# Altium project Timer_Clock.PrjPcb
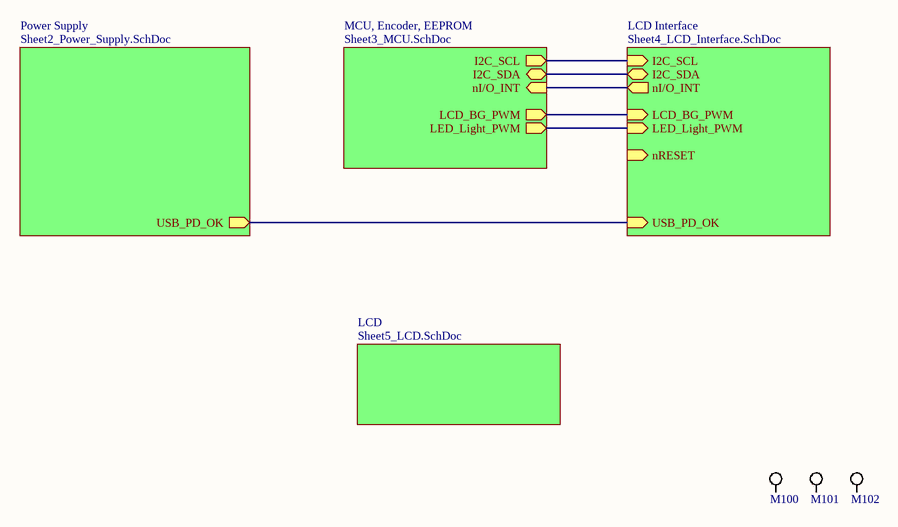
[diagram p0: Sheet1_Overview.SchDoc]
5 sheets, 173 parts. Net scope: hierarchical (ports join the sheet entries above them; power ports are global).
Sheets:
  Sheet1_Overview.SchDoc
    Power Supply = Sheet2_Power_Supply.SchDoc
    MCU, Encoder, EEPROM = Sheet3_MCU.SchDoc
    LCD = Sheet5_LCD.SchDoc
    LCD Interface = Sheet4_LCD_Interface.SchDoc

## Sheet Sheet1_Overview.SchDoc: =ProjectName
size A4; DocumentNumber: 1; SheetNumber: 1; SheetTotal: 5

### Parts
M100  M3x8  [SCREW_M3x8_nP_FH]  (value not drawn)  (net tie, no BOM)
M101  M3x8  [SCREW_M3x8_nP_FH]  (value not drawn)  (net tie, no BOM)
M102  M3x8  [SCREW_M3x8_nP_FH]  (value not drawn)  (net tie, no BOM)

### Sub-sheets
LCD = Sheet5_LCD.SchDoc: no entries
LCD Interface = Sheet4_LCD_Interface.SchDoc: nI/O_INT (out), I2C_SCL (in), LCD_BG_PWM (in), nRESET (in), LED_Light_PWM (in), I2C_SDA (bidir), USB_PD_OK (in)
MCU, Encoder, EEPROM = Sheet3_MCU.SchDoc: nI/O_INT (in), I2C_SCL (out), LCD_BG_PWM (out), LED_Light_PWM (out), I2C_SDA (bidir)
Power Supply = Sheet2_Power_Supply.SchDoc: USB_PD_OK (out)

### Nets
I2C_SCL: sheet MCU, Encoder, EEPROM/I2C_SCL, sheet LCD Interface/I2C_SCL
I2C_SDA: sheet MCU, Encoder, EEPROM/I2C_SDA, sheet LCD Interface/I2C_SDA
LCD_BG_PWM: sheet MCU, Encoder, EEPROM/LCD_BG_PWM, sheet LCD Interface/LCD_BG_PWM
LED_Light_PWM: sheet MCU, Encoder, EEPROM/LED_Light_PWM, sheet LCD Interface/LED_Light_PWM
nI/O_INT: sheet MCU, Encoder, EEPROM/nI/O_INT, sheet LCD Interface/nI/O_INT
NetP201_3: sheet Power Supply/USB_PD_OK, sheet LCD Interface/USB_PD_OK

### Notes on the sheet
- Title
- Size:
- Date:
- A4
- Number:
- Time:
- Revision:
- Sheet
- of
- File:

### Library data of the parts
M100-M102 = SCREW_M3x8_nP_FH: Skrew M3x8 Not Plated Flathat

## Sheet Sheet2_Power_Supply.SchDoc: =ProjectName
size A4; DocumentNumber: 2; SheetNumber: 2; SheetTotal: 5
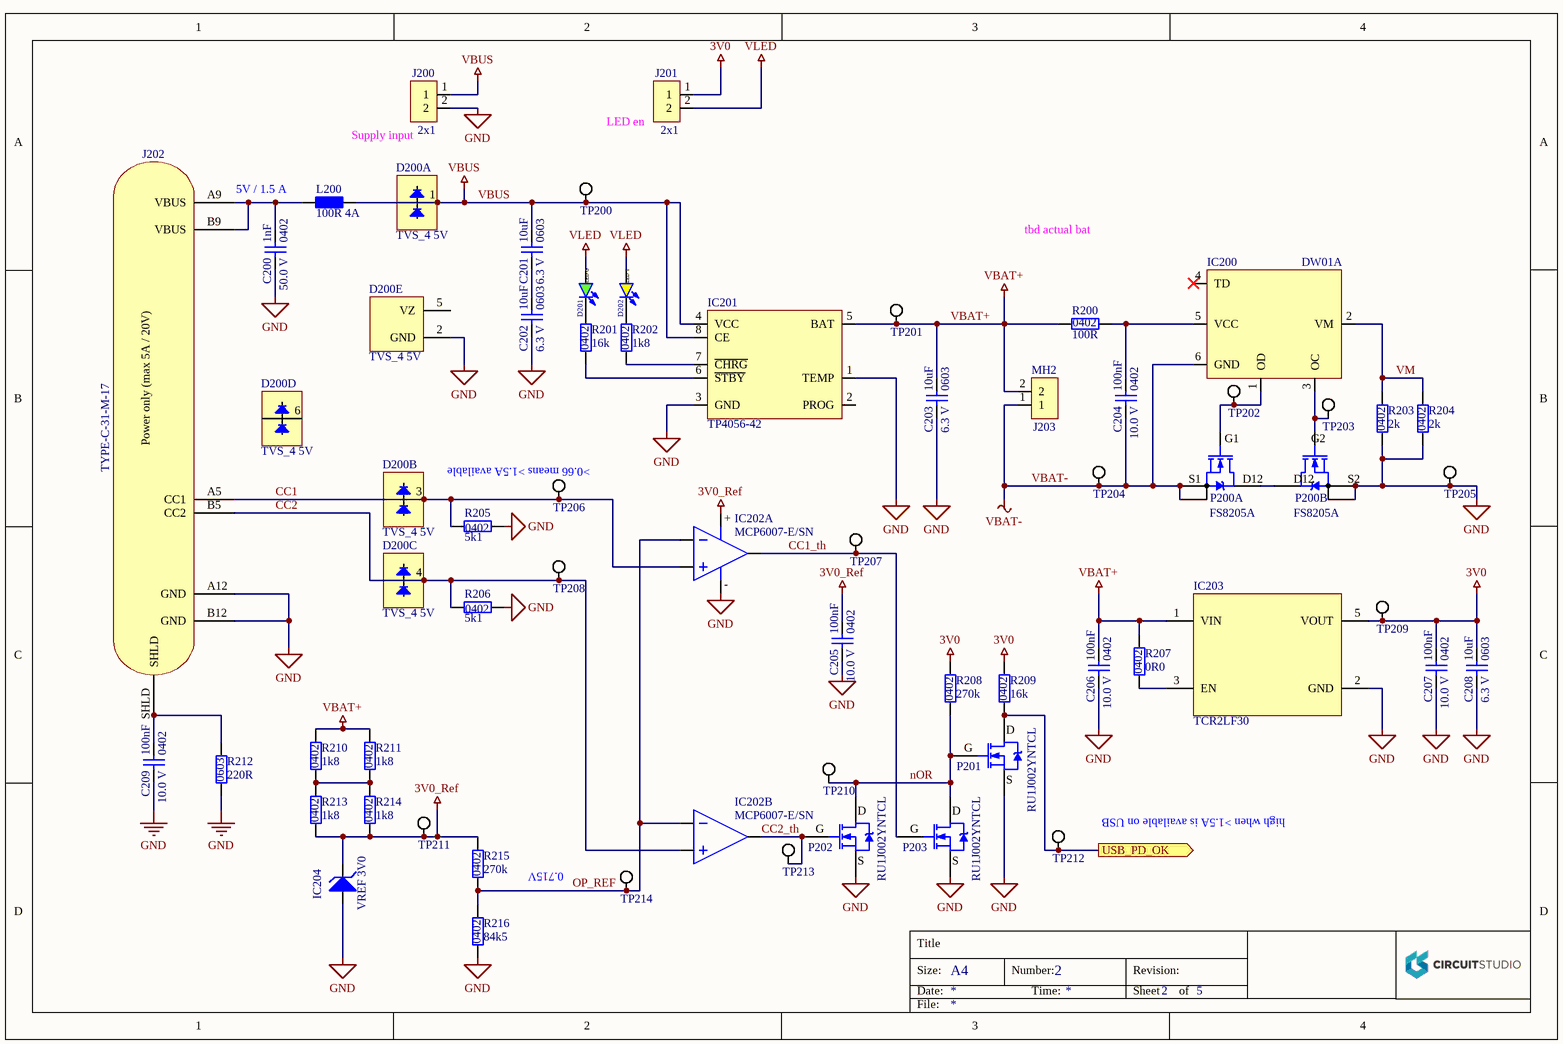
[diagram p1: Sheet2_Power_Supply.SchDoc]

### Parts
C200  Capacitance: 1nF  Footprint: 0402  Voltage: 50.0 V  [C_0402]  (hidden comment: C 1nF 0402 50V)
C201  Capacitance: 10uF  Footprint: 0603  Voltage: 6.3 V  [C_0603]  (hidden comment: C 10uF 0603 6.3V)
C202  Capacitance: 10uF  Footprint: 0603  Voltage: 6.3 V  [C_0603]  (hidden comment: C 10uF 0603 6.3V)
C203  Capacitance: 10uF  Footprint: 0603  Voltage: 6.3 V  [C_0603]  (hidden comment: C 10uF 0603 6.3V)
C204  Capacitance: 100nF  Footprint: 0402  Voltage: 10.0 V  [C_0402]  (hidden comment: C 100nF 0402 10V)
C205  Capacitance: 100nF  Footprint: 0402  Voltage: 10.0 V  [C_0402]  (hidden comment: C 100nF 0402 10V)
C206  Capacitance: 100nF  Footprint: 0402  Voltage: 10.0 V  [C_0402]  (hidden comment: C 100nF 0402 10V)
C207  Capacitance: 100nF  Footprint: 0402  Voltage: 10.0 V  [C_0402]  (hidden comment: C 100nF 0402 10V)
C208  Capacitance: 10uF  Footprint: 0603  Voltage: 6.3 V  [C_0603]  (hidden comment: C 10uF 0603 6.3V)
C209  Capacitance: 100nF  Footprint: 0402  Voltage: 10.0 V  [C_0402]  (hidden comment: C 100nF 0402 10V)
D200  TVS_4 5V  [SOT-23-6]  (parts A,B,C,D,E of 5)
D201  LED G  [LED_0603]
D202  LED Y  [LED_0603]
IC200  DW01A  [SOT-23-6]
IC201  TP4056-42  [SOIC-8-EP]
IC202  MCP6007-E/SN  [SOIC-8]  (parts A,B of 2)
IC203  TCR2LF30  [SOT-23-5]
IC204  VREF 3V0  [SOT-23-3]
J200  2x1  [PH_1x2]
J201  2x1  [PH_1x2]
J202  TYPE-C-31-M-17  [Con_TYPE-C-31-M-17]
J203  MH2  [J_S2B-PH-K-S]
L200  Inductance: 100R 4A  [L_1206]  (hidden comment: L Ferrite 100R 4A)
P200  Manufacturer Part Number: FS8205A  [TSSOP-8_4.4mm]  (hidden comment: P2 NMOS 20V 6A)  (parts A,B of 2)
P201  Manufacturer Part Number: RU1J002YNTCL  [UMT3F]  (hidden comment: P_NCH_50V_150mW)
P202  Manufacturer Part Number: RU1J002YNTCL  [UMT3F]  (hidden comment: P_NCH_50V_150mW)
P203  Manufacturer Part Number: RU1J002YNTCL  [UMT3F]  (hidden comment: P_NCH_50V_150mW)
R200  Resistance: 100R  Footprint: 0402  [R_0402]  (hidden comment: R 100R 0402)
R201  Resistance: 16k  Footprint: 0402  [R_0402]  (hidden comment: R 16k 0402)
R202  Resistance: 1k8  Footprint: 0402  [R_0402]  (hidden comment: R 1k8 0402)
R203  Resistance: 2k  Footprint: 0402  [R_0402]  (hidden comment: R 2k 0402)
R204  Resistance: 2k  Footprint: 0402  [R_0402]  (hidden comment: R 2k 0402)
R205  Resistance: 5k1  Footprint: 0402  [R_0402]  (hidden comment: R 5k1 0402)
R206  Resistance: 5k1  Footprint: 0402  [R_0402]  (hidden comment: R 5k1 0402)
R207  Resistance: 0R0  Footprint: 0402  [R_0402]  (hidden comment: R 0R0 0402)
R208  Resistance: 270k  Footprint: 0402  [R_0402]  (hidden comment: R 270k 0402)
R209  Resistance: 16k  Footprint: 0402  [R_0402]  (hidden comment: R 16k 0402)
R210  Resistance: 1k8  Footprint: 0402  [R_0402]  (hidden comment: R 1k8 0402)
R211  Resistance: 1k8  Footprint: 0402  [R_0402]  (hidden comment: R 1k8 0402)
R212  Resistance: 220R  Footprint: 0603  [R_0603]  (hidden comment: R 220R 0603)
R213  Resistance: 1k8  Footprint: 0402  [R_0402]  (hidden comment: R 1k8 0402)
R214  Resistance: 1k8  Footprint: 0402  [R_0402]  (hidden comment: R 1k8 0402)
R215  Resistance: 270k  Footprint: 0402  [R_0402]  (hidden comment: R 270k 0402)
R216  Resistance: 84k5  Footprint: 0402  [R_0402]  (hidden comment: R 84k5 0402)
TP200  TP  [TP_1mm]  (value not drawn)  (net tie, no BOM)
TP201  TP  [TP_1mm]  (value not drawn)  (net tie, no BOM)
TP202  TP  [TP_1mm]  (value not drawn)  (net tie, no BOM)
TP203  TP  [TP_1mm]  (value not drawn)  (net tie, no BOM)
TP204  TP  [TP_1mm]  (value not drawn)  (net tie, no BOM)
TP205  TP  [TP_1mm]  (value not drawn)  (net tie, no BOM)
TP206  TP  [TP_1mm]  (value not drawn)  (net tie, no BOM)
TP207  TP  [TP_1mm]  (value not drawn)  (net tie, no BOM)
TP208  TP  [TP_1mm]  (value not drawn)  (net tie, no BOM)
TP209  TP  [TP_1mm]  (value not drawn)  (net tie, no BOM)
TP210  TP  [TP_1mm]  (value not drawn)  (net tie, no BOM)
TP211  TP  [TP_1mm]  (value not drawn)  (net tie, no BOM)
TP212  TP  [TP_1mm]  (value not drawn)  (net tie, no BOM)
TP213  TP  [TP_1mm]  (value not drawn)  (net tie, no BOM)
TP214  TP  [TP_1mm]  (value not drawn)  (net tie, no BOM)

### Ports
USB_PD_OK (out)

### Nets
3V0: C207.2 C208.2 IC203.5(VOUT) J201.1 R208.2 R209.2 TP209.1(TP)
3V0_Ref: C205.2 IC202.8(VDD) IC204.1(K) R213.1 R214.1 R215.2 TP211.1(TP)
GND: C200.1 C202.1 C203.1 C205.1 C206.1 C207.1 C208.1 C209.1 D200.2(GND) IC201.1(TEMP) IC201.3(GND) IC202.4(VSS) IC203.2(GND) IC204.2(A) J200.2 J202.A12(GND) J202.B12(GND) P200.6(S2) P200.7(S2) P201.2(S) P202.2(S) P203.2(S) R203.1 R204.1 R205.1 R206.1 R212.1 R216.1 TP205.1(TP)
VBAT+: C203.2 C206.2 IC201.5(BAT) IC203.1(VIN) J203.2 R200.1 R207.2 R210.2 R211.2 TP201.1(TP)
VBAT-: C204.1 IC200.6(GND) J203.1 P200.2(S1) P200.3(S1) TP204.1(TP)
VBUS: C201.2 D200.1 IC201.4(VCC) IC201.8(CE) J200.1 L200.2 TP200.1(TP)
VLED: D201.A D202.A J201.2
CC1: D200.3 IC202.3(INA+) J202.A5(CC1) R205.2 TP206.1(TP)
CC1_th: IC202.1(OUTA) P203.1(G) TP207.1(TP)
CC2: D200.4 IC202.5(INB+) J202.B5(CC2) R206.2 TP208.1(TP)
CC2_th: IC202.7(OUTB) P202.1(G) TP213.1(TP)
nOR: P201.1(G) P202.3(D) P203.3(D) R208.1 TP210.1(TP)
OP_REF: IC202.2(INA-) IC202.6(INB-) R215.1 R216.2 TP214.1(TP)
VM: IC200.2(VM) R203.2 R204.2
NetC200_2: C200.2 J202.A9(VBUS) J202.B9(VBUS) L200.1
NetC201_1: C201.1 C202.2
NetC204_2: C204.2 IC200.5(VCC) R200.2
NetC209_2: C209.2 J202.SHLD R212.2
NetD201_K: D201.K R201.2
NetD202_K: D202.K R202.2
NetIC200_1: IC200.1(OD) P200.4(G1) TP202.1(TP)
NetIC200_3: IC200.3(OC) P200.5(G1) TP203.1(TP)
NetIC201_6: IC201.6(~{STBY}) R201.1
NetIC201_7: IC201.7(~{CHRG}) R202.1
NetIC203_3: IC203.3(EN) R207.1
NetP200_1: P200.1(D12) P200.8(D12)
NetP201_3: P201.3(D) R209.1 TP212.1(TP) ; port USB_PD_OK
NetR210_1: R210.1 R211.1 R213.2 R214.2

Not connected (* = marked no-connect by the designer): D200 5(VZ) 6; IC200 4(TD)*; IC201 2(PROG)

### Notes on the sheet
- (near J201) LED en
- 5V / 1.5 A
- (near J200) Supply input
- tbd actual bat
- (near TP206) >0.66 means >1.5A available
- (near TP212) high when >1.5A is available on USB
- 0.715V
- Title
- Size:
- Date:
- A4
- Number:
- Time:
- Revision:
- Sheet
- of
- File:
- (in symbol IC_OpAmp_MCP6007-E/SN, part A) +; -
- (in symbol J_USB-C_2) Power only (max 5A / 20V)
- (in symbol P_2NCH_20V_1W, part B) G2

### Library data of the parts
C200 = CAP_1nF_50V_0402: CAP CER 1000PF 50V C0G/NP0 0402; Manufacturer: Murata Electronics; Manufacturer Part Number: GRM1555C1H102JA01J; Type: Capacitor; Supplier 1: Digi-Key; Supplier Part Number 1: 490-6190-1-ND
C201-C203 C208 = CAP_10uF_6V3_0603: CAP CER 10UF 6.3V X5R 0603; Manufacturer: Taiyo Yuden; Manufacturer Part Number: JMK107ABJ106MA-T; Type: Capacitor; Supplier 1: Digi-Key; Supplier Part Number 1: 587-5869-1-ND
C204-C207 C209 = CAP_100nF_10V_0402: CAP CER 0.1UF 10V X5R 0402; Manufacturer: Samsung Electro-Mechanics; Manufacturer Part Number: CL05A104MP5NNNC; Type: Capacitor; Supplier 1: Digi-Key; Supplier Part Number 1: 1276-1443-1-ND
D200 = D_TVS_U4_12V5: TVS DIODE 5VWM 12.5VC SOT23-6; Manufacturer: Comchip Technology; Manufacturer Part Number: CPDT6-5V0UPC-HF; Type: Diode, TVS; Supplier 1: Digi-Key; Supplier Part Number 1: 641-1829-1-ND
D201 = D_LED_Green_0603: LED GREEN DIFFUSED 0603 SMD; Manufacturer: OSRAM Opto Semiconductors Inc.; Manufacturer Part Number: LT Q39G-Q1OO-25-1; Type: Diode, LED; Supplier 1: Digi-Key; Supplier Part Number 1: 475-3442-1-ND
D202 = D_LED_Yellow_0603: LED YELLOW DIFFUSED; Manufacturer: Stanley Electric Co; Manufacturer Part Number: FKY1111C-TR; Type: Diode, LED; Supplier 1: Digi-Key; Supplier Part Number 1: 404-1273-1-ND
IC200 = IC_BAT_PROT_DW01A: IC BATT MANAGEMENT SOT-23-6; Manufacturer: PUOLOP; Manufacturer Part Number: DW01A; Type: IC; Supplier 1: JLCPCB; Supplier Part Number 1: C351410
IC201 = IC_BAT_CHGR_TP4056: IC BATT CHG LI-ION 1CELL ESOP-8-EP; Manufacturer: TOPPOWER(Nanjing Extension Microelectronics); Manufacturer Part Number: TP4056-42-ESOP8; Type: IC; Supplier 1: JLCPCB; Supplier Part Number 1: C16581
IC202 = IC_OpAmp_MCP6007-E/SN: DUAL, 1MHZ OP AMP, E TEMP; Manufacturer: Microchip Technology; Type: IC, OpAmp; Supplier 1: Digi-Key; Supplier Part Number 1: 150-MCP6007-E/SN-ND; Manufacturer Part Number: MCP6007-E/SN
IC203 = IC_Reg_TCR2LF30: IC REG LINEAR 3V 200MA SMV; Manufacturer: Toshiba Semiconductor and Storage; Manufacturer Part Number: TCR2LF30,LM(CT; Type: IC, Regulator; Supplier 1: Digi-Key; Supplier Part Number 1: TCR2LF30LM(CTCT-ND
IC204 = IC_Ref_LM4040DIM3X-3.0: IC VREF SHUNT 1% SOT23-3; Manufacturer: Texas Instruments; Manufacturer Part Number: LM4040DIM3X-3.0/NOPB; Type: IC, Reference; Supplier 1: Digi-Key; Supplier Part Number 1: 296-41429-1-ND
J200 J201 = J_MH2x1_2.54: CONN HEADER VERT 2POS 2.54MM; Manufacturer: Sullins Connector Solutions; Manufacturer Part Number: PRPC002SAAN-RC; Pitch: 2.54; Type: Connector; Supplier 1: Digi-Key; Supplier Part Number 1: S1011EC-02-ND; Pins: 2
J202 = J_USB-C_2: USB4 GEN3, TYPE C, TOP MOUNT; Manufacturer: Korean Hroparts Elec; Manufacturer Part Number: TYPE-C-31-M-17; Type: Connector; Supplier 1: JLCPCB; Supplier Part Number 1: C283540; Pins: 6; Pitch: *
J203 = J_S2B-PH-KL: CONN HEADER R/A 2POS 2MM; Manufacturer: JST Sales America Inc.; Manufacturer Part Number: S2B-PH-KL(LF)(SN); Pitch: 2; Type: Connector; Supplier 1: JLCPCB; Supplier Part Number 1: C160237; Pins: 2
L200 = L_100R_4A: FIXED IND 100 4000MA 1206; Manufacturer: Eaton - Electronics Division; Manufacturer Part Number: MFBM1V3216-101-R; Type: Inductor, Ferrite; Supplier 1: Digi-Key; Supplier Part Number 1: 283-MFBM1V3216-101-RCT-ND
P200 = P_2NCH_20V_1W: MOSFET 2N_CH 20V 6A TSSOP-8; Manufacturer: Fortune Semicon; Type: Transistor; Supplier 1: JLCPCB; Supplier Part Number 1: C16052
P201-P203 = P_NCH_50V_150mW: MOSFET N-CH 50V 200MA UMT3F; Manufacturer: Rohm Semiconductor; Type: Transistor; Supplier 1: Digi-Key; Supplier Part Number 1: RU1J002YNTCLCT-ND
R200 = R_100R_0402: RES 100 OHM 1% 1/16W 0402; Manufacturer: Stackpole Electronics Inc; Manufacturer Part Number: RMCF0402FT100R; Type: Resistor; Supplier 1: Digi-Key; Supplier Part Number 1: RMCF0402FT100RCT-ND
R201 R209 = R_16k_0402: RES 16K OHM 1% 1/16W 0402; Manufacturer: Stackpole Electronics Inc; Manufacturer Part Number: RMCF0402FT16K0; Type: Resistor; Supplier 1: Digi-Key; Supplier Part Number 1: RMCF0402FT16K0CT-ND
R202 R210 R211 R213 R214 = R_1k8_0402: RES 1.8K OHM 1% 1/16W 0402; Manufacturer: Stackpole Electronics Inc; Manufacturer Part Number: RMCF0402FT1K80; Type: Resistor; Supplier 1: Digi-Key; Supplier Part Number 1: RMCF0402FT1K80CT-ND
R203 R204 = R_2k_0402: RES 2K OHM 1% 1/16W 0402; Manufacturer: Stackpole Electronics Inc; Manufacturer Part Number: RMCF0402FT2K00; Type: Resistor; Supplier 1: Digi-Key; Supplier Part Number 1: RMCF0402FT2K00CT-ND
R205 R206 = R_5k1_0420: RES 5.1K OHM 1% 1/16W 0402; Manufacturer: Stackpole Electronics Inc; Manufacturer Part Number: RMCF0402FT5K10; Type: Resistor; Supplier 1: Digi-Key; Supplier Part Number 1: RMCF0402FT5K10CT-ND
R207 = R_0R0_0402: RES 0 OHM JUMPER 1/16W 0402; Manufacturer: Stackpole Electronics Inc; Manufacturer Part Number: RMCF0402ZT0R00; Type: Resistor; Supplier 1: Digi-Key; Supplier Part Number 1: RMCF0402ZT0R00CT-ND
R208 R215 = R_270k_0402: RES 270K OHM 1% 1/16W 0402; Manufacturer: YAGEO; Manufacturer Part Number: RC0402FR-07270KL; Type: Resistor; Supplier 1: Digi-Key; Supplier Part Number 1: 311-270KLRCT-ND
R212 = R_220R_0603: RES 220 OHM 1% 1/10W 0603; Manufacturer: Stackpole Electronics Inc; Manufacturer Part Number: RMCF0603FT220R; Type: Resistor; Supplier 1: Digi-Key; Supplier Part Number 1: RMCF0603FT220RCT-ND
R216 = R_84k5_0402: RES SMD 84.5K OHM 1% 1/16W 0402; Manufacturer: Vishay Dale; Manufacturer Part Number: CRCW040284K5FKED; Type: Resistor; Supplier 1: Digi-Key; Supplier Part Number 1: 541-84.5KLCT-ND
TP200-TP214 = TP_1mm: Test Point 1mm

## Sheet Sheet3_MCU.SchDoc: =ProjectName
size A4; DocumentNumber: 3; SheetNumber: 3; SheetTotal: 5
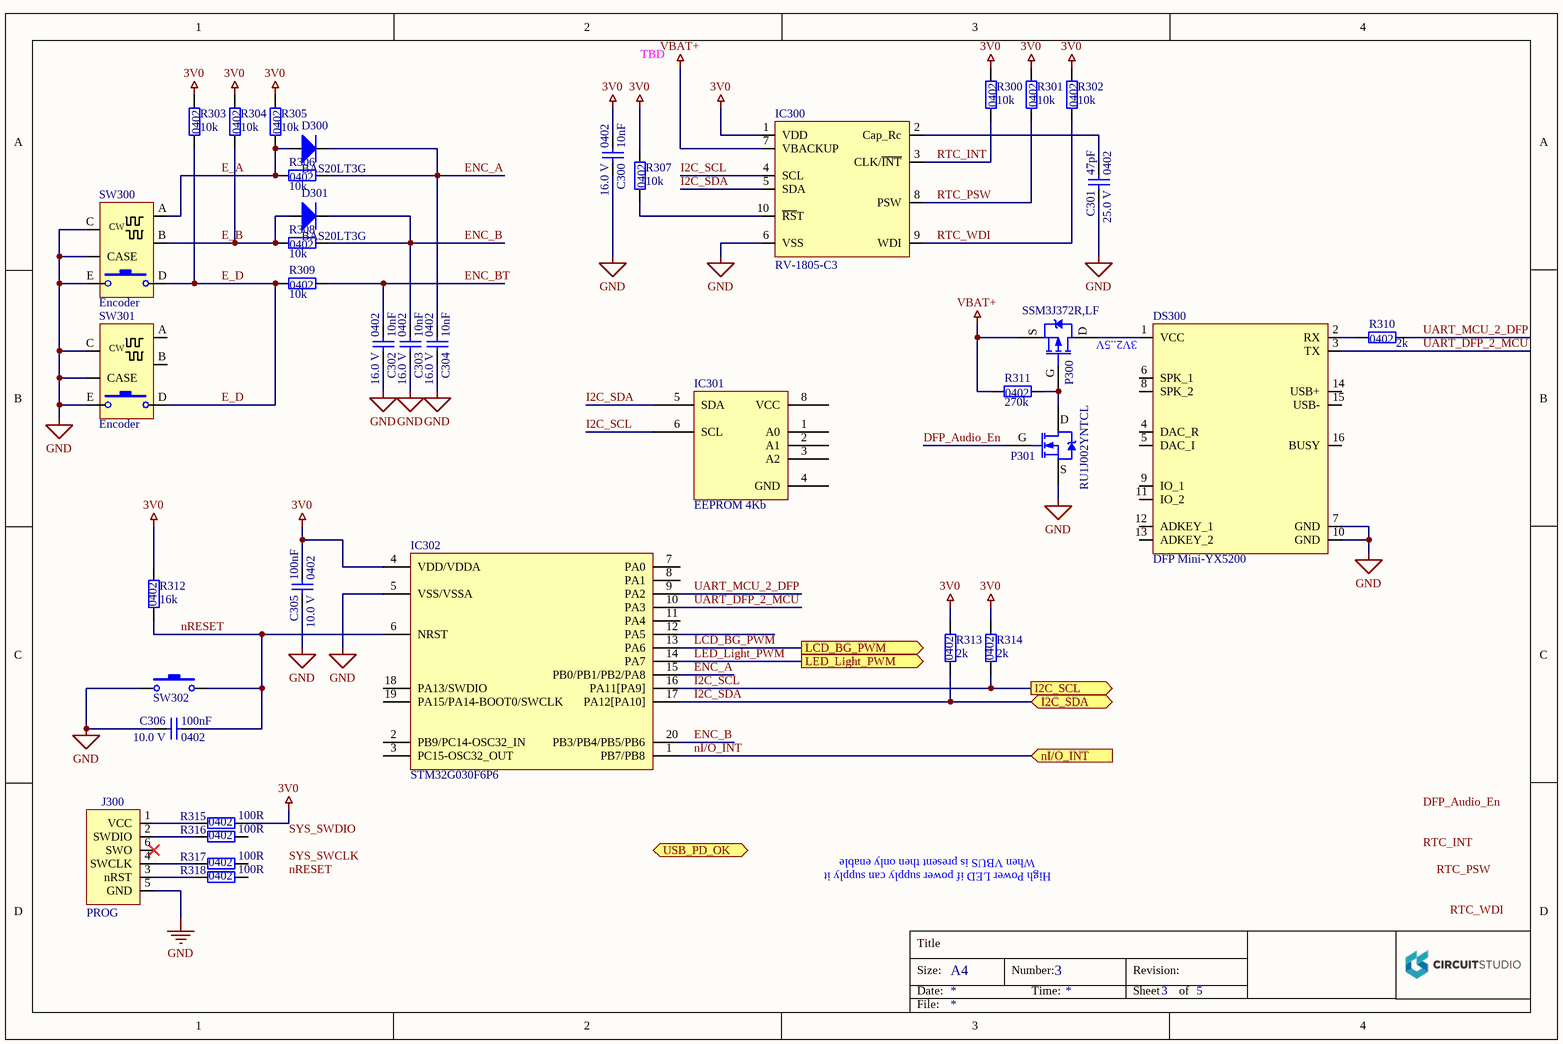
[diagram p2: Sheet3_MCU.SchDoc]

### Parts
C300  Capacitance: 10nF  Footprint: 0402  Voltage: 16.0 V  [C_0402]  (hidden comment: C 10nF 0402 16V)
C301  Capacitance: 47pF  Footprint: 0402  Voltage: 25.0 V  [C_0402]  (hidden comment: C 47pF 0402 25V)
C302  Capacitance: 10nF  Footprint: 0402  Voltage: 16.0 V  [C_0402]  (hidden comment: C 10nF 0402 16V)
C303  Capacitance: 10nF  Footprint: 0402  Voltage: 16.0 V  [C_0402]  (hidden comment: C 10nF 0402 16V)
C304  Capacitance: 10nF  Footprint: 0402  Voltage: 16.0 V  [C_0402]  (hidden comment: C 10nF 0402 16V)
C305  Capacitance: 100nF  Footprint: 0402  Voltage: 10.0 V  [C_0402]  (hidden comment: C 100nF 0402 10V)
C306  Capacitance: 100nF  Footprint: 0402  Voltage: 10.0 V  [C_0402]  (hidden comment: C 100nF 0402 10V)
D300  BAS20LT3G  [SOT-23-3]
D301  BAS20LT3G  [SOT-23-3]
DS300  DFP Mini-YX5200  [DFP_Player_Mini]
IC300  RV-1805-C3  [SON-6]
IC301  EEPROM 4Kb  [TSSOP-8_4.4mm]
IC302  STM32G030F6P6  [TSSOP-20]
J300  PROG  [J_TC2030-IDC-FP]
P300  Manufacturer Part Number: SSM3J372R,LF  [SOT-23-3-F]  (hidden comment: P PMOS 30V 6A)
P301  Manufacturer Part Number: RU1J002YNTCL  [UMT3F]  (hidden comment: P_NCH_50V_150mW)
R300  Resistance: 10k  Footprint: 0402  [R_0402]  (hidden comment: R 10k 0402)
R301  Resistance: 10k  Footprint: 0402  [R_0402]  (hidden comment: R 10k 0402)
R302  Resistance: 10k  Footprint: 0402  [R_0402]  (hidden comment: R 10k 0402)
R303  Resistance: 10k  Footprint: 0402  [R_0402]  (hidden comment: R 10k 0402)
R304  Resistance: 10k  Footprint: 0402  [R_0402]  (hidden comment: R 10k 0402)
R305  Resistance: 10k  Footprint: 0402  [R_0402]  (hidden comment: R 10k 0402)
R306  Resistance: 10k  Footprint: 0402  [R_0402]  (hidden comment: R 10k 0402)
R307  Resistance: 10k  Footprint: 0402  [R_0402]  (hidden comment: R 10k 0402)
R308  Resistance: 10k  Footprint: 0402  [R_0402]  (hidden comment: R 10k 0402)
R309  Resistance: 10k  Footprint: 0402  [R_0402]  (hidden comment: R 10k 0402)
R310  Resistance: 2k  Footprint: 0402  [R_0402]  (hidden comment: R 2k 0402)
R311  Resistance: 270k  Footprint: 0402  [R_0402]  (hidden comment: R 270k 0402)
R312  Resistance: 16k  Footprint: 0402  [R_0402]  (hidden comment: R 16k 0402)
R313  Resistance: 2k  Footprint: 0402  [R_0402]  (hidden comment: R 2k 0402)
R314  Resistance: 2k  Footprint: 0402  [R_0402]  (hidden comment: R 2k 0402)
R315  Resistance: 100R  Footprint: 0402  [R_0402]  (hidden comment: R 100R 0402)
R316  Resistance: 100R  Footprint: 0402  [R_0402]  (hidden comment: R 100R 0402)
R317  Resistance: 100R  Footprint: 0402  [R_0402]  (hidden comment: R 100R 0402)
R318  Resistance: 100R  Footprint: 0402  [R_0402]  (hidden comment: R 100R 0402)
SW300  Encoder  [PEC11R]
SW301  Encoder  [PEC11R]
SW302  SW  [SW_PTS810]  (value not drawn)

### Ports
I2C_SCL (out), I2C_SDA (bidir), LCD_BG_PWM (out), LED_Light_PWM (out), nI/O_INT (in), USB_PD_OK (in)

### Nets
3V0: C300.2 C305.2 IC300.1(VDD) IC302.4(VDD/VDDA) R300.2 R301.2 R302.2 R303.2 R304.2 R305.2 R307.2 R312.2 R313.2 R314.2 R315.2
GND: C300.1 C301.1 C302.1 C303.1 C304.1 C305.1 C306.1 DS300.7(GND) DS300.10(GND) IC300.6(VSS) IC302.5(VSS/VSSA) J300.5(GND) P301.2(S) SW300.C SW300.CASE SW300.E SW301.C SW301.CASE SW301.E SW302.1(1,_2)
VBAT+: IC300.7(VBACKUP) P300.2(S) R311.2
DFP_Audio_En: P301.1(G)
E_A: D300.1(A) R305.1 R306.1 SW300.A
E_B: D301.1(A) R304.1 R308.1 SW300.B
E_D: R303.1 R309.1 SW300.D SW301.D
ENC_A: C304.2 D300.3(K) IC302.15(PB0/PB1/PB2/PA8) R306.2
ENC_B: C303.2 D301.3(K) IC302.20(PB3/PB4/PB5/PB6) R308.2
ENC_BT: C302.2 R309.2
I2C_SCL: IC300.4(SCL) IC301.6(SCL) IC302.16(PA11[PA9]) R314.1 ; port I2C_SCL
I2C_SDA: IC300.5(SDA) IC301.5(SDA) IC302.17(PA12[PA10]) R313.1 ; port I2C_SDA
LCD_BG_PWM: IC302.13(PA6) ; port LCD_BG_PWM
LED_Light_PWM: IC302.14(PA7) ; port LED_Light_PWM
nI/O_INT: IC302.1(PB7/PB8) ; port nI/O_INT
nRESET: C306.2 IC302.6(NRST) R312.1 SW302.3(2,_3)
RTC_INT: IC300.3(CLK/~{INT}) R300.1
RTC_PSW: IC300.8(PSW) R301.1
RTC_WDI: IC300.9(WDI) R302.1
UART_DFP_2_MCU: DS300.3(TX) IC302.10(PA3)
UART_MCU_2_DFP: IC302.9(PA2) R310.1
NetC301_2: C301.2 IC300.2(Cap_Rc)
NetDS300_1: DS300.1(VCC) P300.3(D)
NetDS300_2: DS300.2(RX) R310.2
NetIC300_10: IC300.10(~{RS}T) R307.1
NetJ300_1: J300.1(VCC) R315.1
NetJ300_2: J300.2(SWDIO) R316.1
NetJ300_3: J300.3(nRST) R318.1
NetJ300_4: J300.4(SWCLK) R317.1
NetP300_1: P300.1(G) P301.3(D) R311.1

Not connected (* = marked no-connect by the designer): DS300 4(DAC_R) 5(DAC_I) 6(SPK_1) 8(SPK_2) 9(IO_1) 11(IO_2) 12(ADKEY_1) 13(ADKEY_2) 14(USB+) 15(USB-) 16(BUSY); IC301 1(A0) 2(A1) 3(A2) 4(GND) 8(VCC); IC302 2(PB9/PC14-OSC32_IN) 3(PC15-OSC32_OUT) 7(PA0) 8(PA1) 11(PA4) 12(PA5) 18(PA13/SWDIO) 19(PA15/PA14-BOOT0/SWCLK); J300 6(SWO)*; R316 2; R317 2; R318 2; SW301 A B

### Notes on the sheet
- TBD
- 3V2..5V
- When VBUS is present then only enable
- High Power LED if power supply can supply it
- Labels drawn without touching a wire or pin: DFP_Audio_En, nRESET, RTC_INT, RTC_PSW, RTC_WDI, SYS_SWCLK, SYS_SWDIO
- Title
- Size:
- Date:
- A4
- Number:
- Time:
- Revision:
- Sheet
- of
- File:
- (in symbol ENC_12_THT) CW

### Library data of the parts
C300 C302-C304 = CAP_10nF_16V_0402: CAP CER 10000PF 16V Y5V 0402; Manufacturer: Samsung Electro-Mechanics; Manufacturer Part Number: CL05F103ZO5NNNC; Type: Capacitor; Supplier 1: Digi-Key; Supplier Part Number 1: 1276-1738-1-ND
C301 = CAP_47pF_25V_0402: CAP CER 47PF 25V C0G/NP0 0402; Manufacturer: KEMET; Manufacturer Part Number: C0402C470J3GAC7867; Type: Capacitor; Supplier 1: Digi-Key; Supplier Part Number 1: 399-C0402C470J3GAC7867CT-ND
C305 C306 = CAP_100nF_10V_0402: as C204 on sheet Sheet2_Power_Supply; Supplier 1: Digi-Key; Supplier Part Number 1: 1276-1443-1-ND
D300 D301 = D_LL_200V_200mA: DIODE GP 200V 200MA SOT23-3; Manufacturer: onsemi; Type: Diode; Supplier 1: Digi-Key; Supplier Part Number 1: BAS20LT3GOSCT-ND; Manufacturer Part Number: BAS20LT3G
DS300 = DFP_Player_mini: Mini-YX5200 Audio MP3 Modul; Manufacturer: DFRobot; Manufacturer Part Number: DFR0299; Type: other; Supplier 1: AliExpress; Supplier Part Number 1: 33036928283
IC300 = IC_RTC_1805-C3: IC RTC CLK/CALENDAR I2C 10SON; Manufacturer: Micro Crystal AG; Manufacturer Part Number: RV-1805-C3-32.768KHZ-2PPM-TA-QA; Type: IC, RTC; Supplier 1: Digi-Key; Supplier Part Number 1: 2195-RV-1805-C3-32.768KHZ-2PPM-TA-QATR-ND
IC301 = IC_EEPROM_4Kb: IC EEPROM 4KBIT I2C 1MHZ 8TSSOP; Manufacturer: Microchip Technology; Manufacturer Part Number: AT34C04-X5M-T; Type: IC, EEPROM; Supplier 1: Digi-Key; Supplier Part Number 1: AT34C04-X5M-TCT-ND
IC302 = IC_MCU_STM32G030F6P6: IC MCU 32BIT 32KB FLASH 20TSSOP; Manufacturer: STMicroelectronics; Manufacturer Part Number: STM32G030F6P6; Type: IC, MCU; Supplier 1: JLCPCB; Supplier Part Number 1: C724040
J300 = J_TC2030-IDC-FP: SWD Programmer; Manufacturer: Tag_connect; Manufacturer Part Number: TC2030; Type: Connector; Pins: 3
P300 = P_PCH_30V_1W: MOSFET P-CH 30V 6A SOT23F; Manufacturer: Toshiba Semiconductor and Storage; Type: Transistor; Supplier 1: Digi-Key; Supplier Part Number 1: SSM3J372RLFCT-ND
P301 = P_NCH_50V_150mW: as P201 on sheet Sheet2_Power_Supply; Type: Transistor; Supplier 1: Digi-Key; Supplier Part Number 1: RU1J002YNTCLCT-ND
R300-R309 = R_10k_0402: RES 10K OHM 1% 1/16W 0402; Manufacturer: YAGEO; Manufacturer Part Number: RC0402FR-0710KL; Type: Resistor; Supplier 1: Digi-Key; Supplier Part Number 1: 311-10.0KLRCT-ND
R310 R313 R314 = R_2k_0402: as R203 on sheet Sheet2_Power_Supply; Type: Resistor; Supplier 1: Digi-Key; Supplier Part Number 1: RMCF0402FT2K00CT-ND
R311 = R_270k_0402: as R208 on sheet Sheet2_Power_Supply; Type: Resistor; Supplier 1: Digi-Key; Supplier Part Number 1: 311-270KLRCT-ND
R312 = R_16k_0402: as R201 on sheet Sheet2_Power_Supply; Type: Resistor; Supplier 1: Digi-Key; Supplier Part Number 1: RMCF0402FT16K0CT-ND
R315-R318 = R_100R_0402: as R200 on sheet Sheet2_Power_Supply; Type: Resistor; Supplier 1: Digi-Key; Supplier Part Number 1: RMCF0402FT100RCT-ND
SW300 SW301 = ENC_12_THT: ROTARY ENCODER MECHANICAL 12PPR; Manufacturer: Bourns Inc.; Manufacturer Part Number: PEC11R-4220F-S0012; Supplier 1: Digi-Key; Supplier Part Number 1: PEC11R-4220F-S0012-ND; Type: other, Encoder
SW302 = SW_TactileSW_V: SWITCH TACTILE SPST-NO 0.05A 16V; Manufacturer: C&K; Manufacturer Part Number: PTS810 SJM 250 SMTR LFS; Type: Resistor; Supplier 1: Digi-Key; Supplier Part Number 1: CKN10502CT-ND

## Sheet Sheet5_LCD.SchDoc
size A4; Organization: Altium Limited; Address1: 3 Minna Close; Address2: Belrose; Address3: NSW 2085; Address4: Australia; DocumentNumber: 5; SheetNumber: 5; SheetTotal: 5
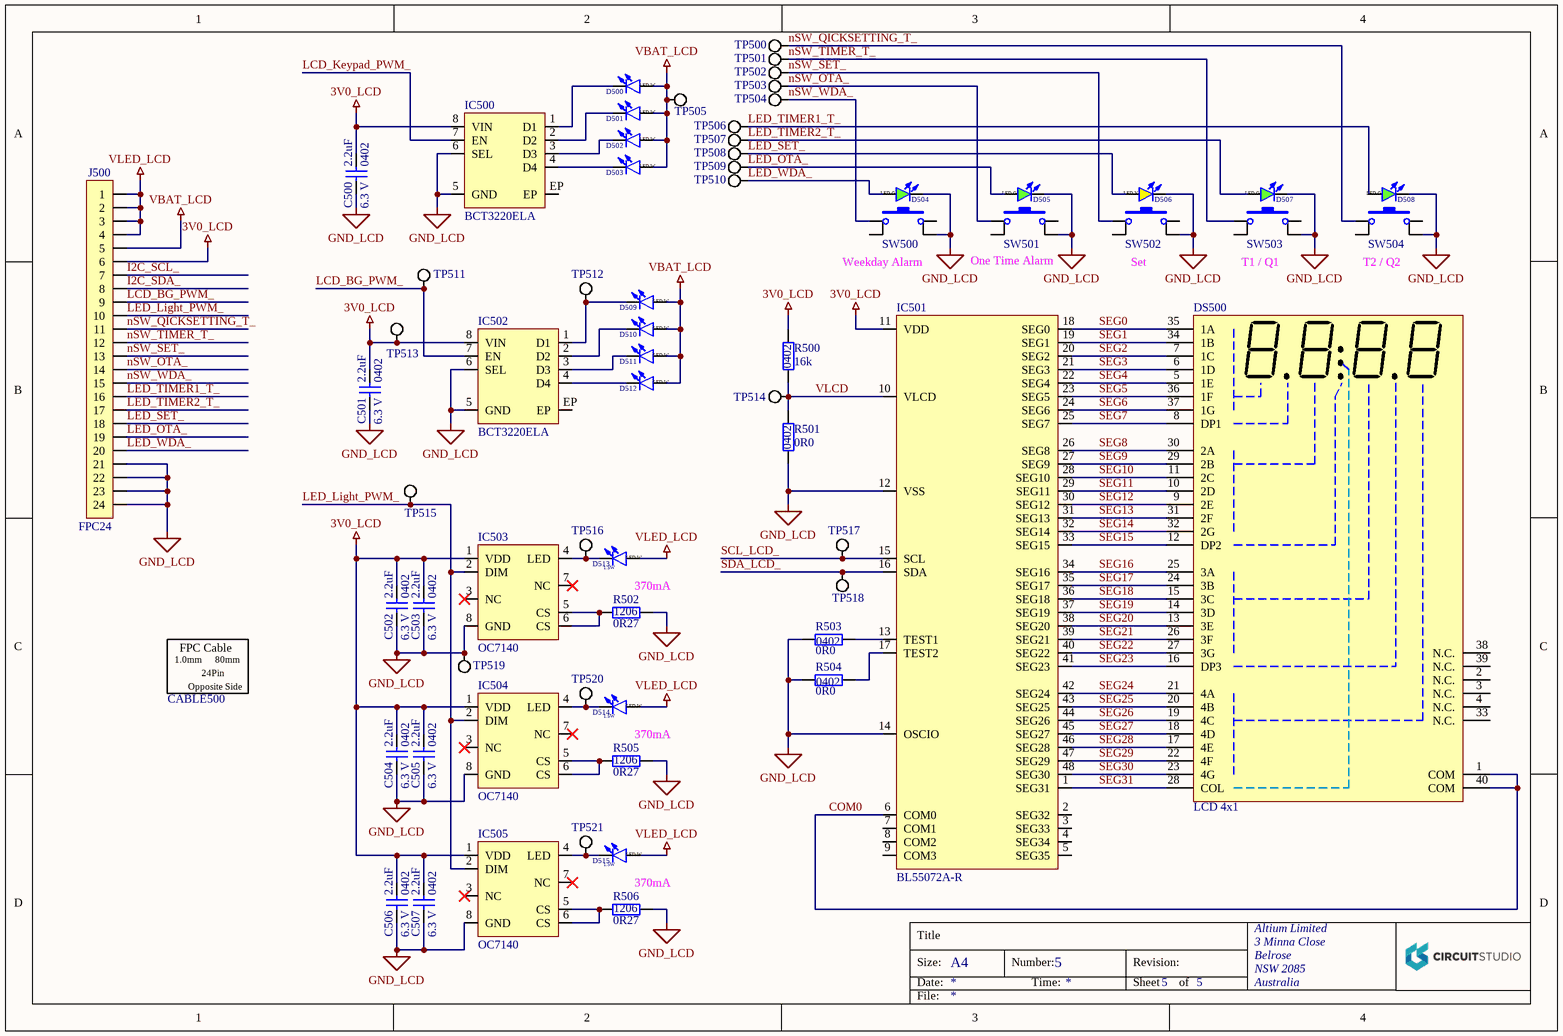
[diagram p3: Sheet5_LCD.SchDoc]

### Parts
C500  Capacitance: 2.2uF  Footprint: 0402  Voltage: 6.3 V  [C_0402]  (hidden comment: C 2.2uF 0402 6.3V)
C501  Capacitance: 2.2uF  Footprint: 0402  Voltage: 6.3 V  [C_0402]  (hidden comment: C 2.2uF 0402 6.3V)
C502  Capacitance: 2.2uF  Footprint: 0402  Voltage: 6.3 V  [C_0402]  (hidden comment: C 2.2uF 0402 6.3V)
C503  Capacitance: 2.2uF  Footprint: 0402  Voltage: 6.3 V  [C_0402]  (hidden comment: C 2.2uF 0402 6.3V)
C504  Capacitance: 2.2uF  Footprint: 0402  Voltage: 6.3 V  [C_0402]  (hidden comment: C 2.2uF 0402 6.3V)
C505  Capacitance: 2.2uF  Footprint: 0402  Voltage: 6.3 V  [C_0402]  (hidden comment: C 2.2uF 0402 6.3V)
C506  Capacitance: 2.2uF  Footprint: 0402  Voltage: 6.3 V  [C_0402]  (hidden comment: C 2.2uF 0402 6.3V)
C507  Capacitance: 2.2uF  Footprint: 0402  Voltage: 6.3 V  [C_0402]  (hidden comment: C 2.2uF 0402 6.3V)
CABLE500  Pitch: 1.0mm  Length: 80mm  Mode: Opposite Side  NoOfPins: 24Pin  (hidden comment: FPC24p80mm)
D500  LED W  [LED_99-218UMC_side]
D501  LED W  [LED_99-218UMC_side]
D502  LED W  [LED_99-218UMC_side]
D503  LED W  [LED_99-218UMC_side]
D504  LED G  [LED_0603]
D505  LED G  [LED_0603]
D506  LED Y  [LED_0603]
D507  LED G  [LED_0603]
D508  LED G  [LED_0603]
D509  LED W  [LED_99-218UMC_side]
D510  LED W  [LED_99-218UMC_side]
D511  LED W  [LED_99-218UMC_side]
D512  LED W  [LED_99-218UMC_side]
D513  LED W  Power: 1.5W  [LED_3.5x3.15]
D514  LED W  Power: 1.5W  [LED_3.5x3.15]
D515  LED W  Power: 1.5W  [LED_3.5x3.15]
DS500  LCD 4x1  [DISPL_7SEG_4]
IC500  BCT3220ELA  [VDFN-8-EP_2x2]
IC501  BL55072A-R  [TSSOP-48]
IC502  BCT3220ELA  [VDFN-8-EP_2x2]
IC503  OC7140  [SOIC-8-EP]
IC504  OC7140  [SOIC-8-EP]
IC505  OC7140  [SOIC-8-EP]
J500  FPC24  [J_FPC_522712479]
R500  Resistance: 16k  Footprint: 0402  [R_0402]  (hidden comment: R 16k 0402)
R501  Resistance: 0R0  Footprint: 0402  [R_0402]  (hidden comment: R 0R0 0402)
R502  Resistance: 0R27  Footprint: 1206  [R_1206]  (hidden comment: R 0R27 1206)
R503  Resistance: 0R0  Footprint: 0402  [R_0402]  (hidden comment: R 0R0 0402)
R504  Resistance: 0R0  Footprint: 0402  [R_0402]  (hidden comment: R 0R0 0402)
R505  Resistance: 0R27  Footprint: 1206  [R_1206]  (hidden comment: R 0R27 1206)
R506  Resistance: 0R27  Footprint: 1206  [R_1206]  (hidden comment: R 0R27 1206)
SW500  SW  [SW_BRIGHT_6.1x6.1]  (value not drawn)
SW501  SW  [SW_BRIGHT_6.1x6.1]  (value not drawn)
SW502  SW  [SW_BRIGHT_6.1x6.1]  (value not drawn)
SW503  SW  [SW_BRIGHT_6.1x6.1]  (value not drawn)
SW504  SW  [SW_BRIGHT_6.1x6.1]  (value not drawn)
TP500  TP  [TP_1mm]  (value not drawn)  (net tie, no BOM)
TP501  TP  [TP_1mm]  (value not drawn)  (net tie, no BOM)
TP502  TP  [TP_1mm]  (value not drawn)  (net tie, no BOM)
TP503  TP  [TP_1mm]  (value not drawn)  (net tie, no BOM)
TP504  TP  [TP_1mm]  (value not drawn)  (net tie, no BOM)
TP505  TP  [TP_1mm]  (value not drawn)  (net tie, no BOM)
TP506  TP  [TP_1mm]  (value not drawn)  (net tie, no BOM)
TP507  TP  [TP_1mm]  (value not drawn)  (net tie, no BOM)
TP508  TP  [TP_1mm]  (value not drawn)  (net tie, no BOM)
TP509  TP  [TP_1mm]  (value not drawn)  (net tie, no BOM)
TP510  TP  [TP_1mm]  (value not drawn)  (net tie, no BOM)
TP511  TP  [TP_1mm]  (value not drawn)  (net tie, no BOM)
TP512  TP  [TP_1mm]  (value not drawn)  (net tie, no BOM)
TP513  TP  [TP_1mm]  (value not drawn)  (net tie, no BOM)
TP514  TP  [TP_1mm]  (value not drawn)  (net tie, no BOM)
TP515  TP  [TP_1mm]  (value not drawn)  (net tie, no BOM)
TP516  TP  [TP_1mm]  (value not drawn)  (net tie, no BOM)
TP517  TP  [TP_1mm]  (value not drawn)  (net tie, no BOM)
TP518  TP  [TP_1mm]  (value not drawn)  (net tie, no BOM)
TP519  TP  [TP_1mm]  (value not drawn)  (net tie, no BOM)
TP520  TP  [TP_1mm]  (value not drawn)  (net tie, no BOM)
TP521  TP  [TP_1mm]  (value not drawn)  (net tie, no BOM)

### Nets
3V0_LCD: C500.2 C501.2 C502.2 C503.2 C504.2 C505.2 C506.2 C507.2 IC500.8(VIN) IC501.11(VDD) IC502.8(VIN) IC503.1(VDD) IC504.1(VDD) IC505.1(VDD) J500.6 R500.2 TP513.1(TP)
GND_LCD: C500.1 C501.1 C502.1 C503.1 C504.1 C505.1 C506.1 C507.1 D504.K D505.K D506.K D507.K D508.K IC500.5(GND) IC500.6(SEL) IC501.12(VSS) IC501.14(OSCIO) IC502.5(GND) IC502.6(SEL) IC503.8(GND) IC504.8(GND) IC505.8(GND) J500.21 J500.22 J500.23 J500.24 R501.1 R502.2 R503.2 R504.2 R505.2 R506.2 SW500.4 SW501.4 SW502.4 SW503.4 SW504.4 TP519.1(TP)
VBAT_LCD: D500.2(A) D501.2(A) D502.2(A) D503.2(A) D509.2(A) D510.2(A) D511.2(A) D512.2(A) J500.5 TP505.1(TP)
VLED_LCD: D513.A D514.A D515.A J500.1 J500.2 J500.3 J500.4
COM0: DS500.1(COM) DS500.40(COM) IC501.6(COM0)
I2C_SCL_: J500.7
I2C_SDA_: J500.8
LCD_BG_PWM_: IC502.7(EN) J500.9 TP511.1(TP)
LCD_Keypad_PWM_: IC500.7(EN)
LED_Light_PWM_: IC503.2(DIM) IC504.2(DIM) IC505.2(DIM) J500.10 TP515.1(TP)
LED_OTA_: D505.A J500.19 TP509.1(TP)
LED_SET_: D506.A J500.18 TP508.1(TP)
LED_TIMER1_T_: D508.A J500.16 TP506.1(TP)
LED_TIMER2_T_: D507.A J500.17 TP507.1(TP)
LED_WDA_: D504.A J500.20 TP510.1(TP)
nSW_OTA_: J500.14 SW501.1 TP503.1(TP)
nSW_QICKSETTING_T_: J500.11 SW504.1 TP500.1(TP)
nSW_SET_: J500.13 SW502.1 TP502.1(TP)
nSW_TIMER_T_: J500.12 SW503.1 TP501.1(TP)
nSW_WDA_: J500.15 SW500.1 TP504.1(TP)
SCL_LCD_: IC501.15(SCL) TP517.1(TP)
SDA_LCD_: IC501.16(SDA) TP518.1(TP)
SEG0: DS500.35(1A) IC501.18(SEG0)
SEG1: DS500.34(1B) IC501.19(SEG1)
SEG2: DS500.7(1C) IC501.20(SEG2)
SEG3: DS500.6(1D) IC501.21(SEG3)
SEG4: DS500.5(1E) IC501.22(SEG4)
SEG5: DS500.36(1F) IC501.23(SEG5)
SEG6: DS500.37(1G) IC501.24(SEG6)
SEG7: DS500.8(DP1) IC501.25(SEG7)
SEG8: DS500.30(2A) IC501.26(SEG8)
SEG9: DS500.29(2B) IC501.27(SEG9)
SEG10: DS500.11(2C) IC501.28(SEG10)
SEG11: DS500.10(2D) IC501.29(SEG11)
SEG12: DS500.9(2E) IC501.30(SEG12)
SEG13: DS500.31(2F) IC501.31(SEG13)
SEG14: DS500.32(2G) IC501.32(SEG14)
SEG15: DS500.12(DP2) IC501.33(SEG15)
SEG16: DS500.25(3A) IC501.34(SEG16)
SEG17: DS500.24(3B) IC501.35(SEG17)
SEG18: DS500.15(3C) IC501.36(SEG18)
SEG19: DS500.14(3D) IC501.37(SEG19)
SEG20: DS500.13(3E) IC501.38(SEG20)
SEG21: DS500.26(3F) IC501.39(SEG21)
SEG22: DS500.27(3G) IC501.40(SEG22)
SEG23: DS500.16(DP3) IC501.41(SEG23)
SEG24: DS500.21(4A) IC501.42(SEG24)
SEG25: DS500.20(4B) IC501.43(SEG25)
SEG26: DS500.19(4C) IC501.44(SEG26)
SEG27: DS500.18(4D) IC501.45(SEG27)
SEG28: DS500.17(4E) IC501.46(SEG28)
SEG29: DS500.22(4F) IC501.47(SEG29)
SEG30: DS500.23(4G) IC501.48(SEG30)
SEG31: DS500.28(COL) IC501.1(SEG31)
VLCD: IC501.10(VLCD) R500.1 R501.2 TP514.1(TP)
NetD500_1: D500.1(K) IC500.1(D1)
NetD501_1: D501.1(K) IC500.2(D2)
NetD502_1: D502.1(K) IC500.3(D3)
NetD503_1: D503.1(K) IC500.4(D4)
NetD509_1: D509.1(K) IC502.1(D1) TP512.1(TP)
NetD510_1: D510.1(K) IC502.2(D2)
NetD511_1: D511.1(K) IC502.3(D3)
NetD512_1: D512.1(K) IC502.4(D4)
NetD513_K: D513.K IC503.4(LED) TP516.1(TP)
NetD514_K: D514.K IC504.4(LED) TP520.1(TP)
NetD515_K: D515.K IC505.4(LED) TP521.1(TP)
NetIC501_13: IC501.13(TEST1) R503.1
NetIC501_17: IC501.17(TEST2) R504.1
NetIC503_5: IC503.5(CS) IC503.6(CS) R502.1
NetIC504_5: IC504.5(CS) IC504.6(CS) R505.1
NetIC505_5: IC505.5(CS) IC505.6(CS) R506.1

Not connected (* = marked no-connect by the designer): DS500 2(N.C.) 3(N.C.) 4(N.C.) 33(N.C.) 38(N.C.) 39(N.C.); IC500 EP; IC501 2(SEG32) 3(SEG33) 4(SEG34) 5(SEG35) 7(COM1) 8(COM2) 9(COM3); IC502 EP; IC503 3(NC)* 7(NC)*; IC504 3(NC)* 7(NC)*; IC505 3(NC)* 7(NC)*; SW500 2 3; SW501 2 3; SW502 2 3; SW503 2 3; SW504 2 3

### Notes on the sheet
- (near SW500) Weekday Alarm
- (near SW501) One Time Alarm
- (near SW502) Set
- (near SW503) T1 / Q1
- (near SW504) T2 / Q2
- 370mA
- Title
- Size:
- Date:
- A4
- Number:
- Time:
- Revision:
- Sheet
- of
- File:
- (in symbol CABLE_FPC24_80) FPC Cable

### Library data of the parts
C500-C507 = CAP_2.2uF_6V3_0402: CAP CER 2.2UF 6.3V X6T 0402; Manufacturer: Murata Electronics; Manufacturer Part Number: GRM155D80J225ME95D; Type: Capacitor; Supplier 1: Digi-Key; Supplier Part Number 1: 490-10450-1-ND
CABLE500 = CABLE_FPC24_80: FPC Cable 1mm Pitch 24Pin 80mm Opposite Sides; Manufacturer: LX; Manufacturer Part Number: C50299; Type: other; Supplier 1: LCSC; Supplier Part Number 1: C50299
D500-D503 D509-D512 = D_LED_White_s: LED WHITE SIDE SMD; Manufacturer: Everlight Elec; Manufacturer Part Number: 99-218UMC/1637CD/TR8-T; Type: Diode, LED; Supplier 1: JLCPCB; Supplier Part Number 1: C710226
D504 D505 D507 D508 = D_LED_Green_0603: as D201 on sheet Sheet2_Power_Supply; Supplier 1: Digi-Key; Supplier Part Number 1: 475-3442-1-ND
D506 = D_LED_Yellow_0603: as D202 on sheet Sheet2_Power_Supply; Supplier 1: Digi-Key; Supplier Part Number 1: 404-1273-1-ND
D513-D515 = D_LED_W_HP: LED XLAMP WARM WHITE 3250K 4SMD; Manufacturer: CreeLED, Inc.; Manufacturer Part Number: MLEAWT-A1-0000-0003F7; Type: Diode, LED; Supplier 1: Digi-Key; Supplier Part Number 1: MLEAWT-A1-0000-0003F7CT-ND
DS500 = DISPL_7SEG_4x1: LCD MOD 4 DIG 4 X 1 REFLECTIVE; Manufacturer: Varitronix; Manufacturer Part Number: VI-402-DP-RC-S; Type: other, Display; Supplier 1: Digi-Key; Supplier Part Number 1: 153-1135-ND
IC500 IC502 = IC_LED_cntr_BCT3220ELA: IC LED DRIVER 4 CH; Manufacturer: BROADCHIP; Manufacturer Part Number: BCT3220ELA-TR; Type: IC, Driver; Supplier 1: JLCPCB; Supplier Part Number 1: C239191
IC501 = IC_LCD_cntr_BL55072A-R: IC LCD DRIVER 36SEG TSSOP-48; Manufacturer: BL(Shanghai Belling); Manufacturer Part Number: BL55072A-R; Type: IC, Driver; Supplier 1: JLCPCB; Supplier Part Number 1: C524044
IC503-IC505 = IC_LED_cntr_OC7140: IC LED DRIVER 1 CH 2A ESOP8; Manufacturer: OCX; Manufacturer Part Number: OC7140; Type: IC, Driver; Supplier 1: JLCPCB; Supplier Part Number 1: C842736
J500 = J_FPC24_DS: CONN FPC BOT 24 PIN 1mm Pitch; Manufacturer: MOLEX; Manufacturer Part Number: 522712479; Pitch: 1.0; Type: Connector; Supplier 1: LCSC; Supplier Part Number 1: C293627; Pins: 24
R500 = R_16k_0402: as R201 on sheet Sheet2_Power_Supply; Type: Resistor; Supplier 1: Digi-Key; Supplier Part Number 1: RMCF0402FT16K0CT-ND
R501 R503 R504 = R_0R0_0402: as R207 on sheet Sheet2_Power_Supply; Type: Resistor; Supplier 1: Digi-Key; Supplier Part Number 1: RMCF0402ZT0R00CT-ND
R502 R505 R506 = R_0R27_1206: RES 0.27 OHM 1% 1/3W 1206; Manufacturer: RALEC; Manufacturer Part Number: RTT06R270FTP; Type: Resistor; Supplier 1: JLCPCB; Supplier Part Number 1: C104939
SW500-SW504 = SW_TactileSW_V_2: SWITCH TACTILE SW-SMD; Manufacturer: BRIGHT; Manufacturer Part Number: TSA063G50-250; Type: other; Supplier 1: LCSC; Supplier Part Number 1: C294565
TP500-TP521 = TP_1mm: Test Point 1mm

## Sheet Sheet4_LCD_Interface.SchDoc
size A4; Organization: Altium Limited; Address1: 3 Minna Close; Address2: Belrose; Address3: NSW 2085; Address4: Australia; DocumentNumber: 4; SheetNumber: 4; SheetTotal: 5
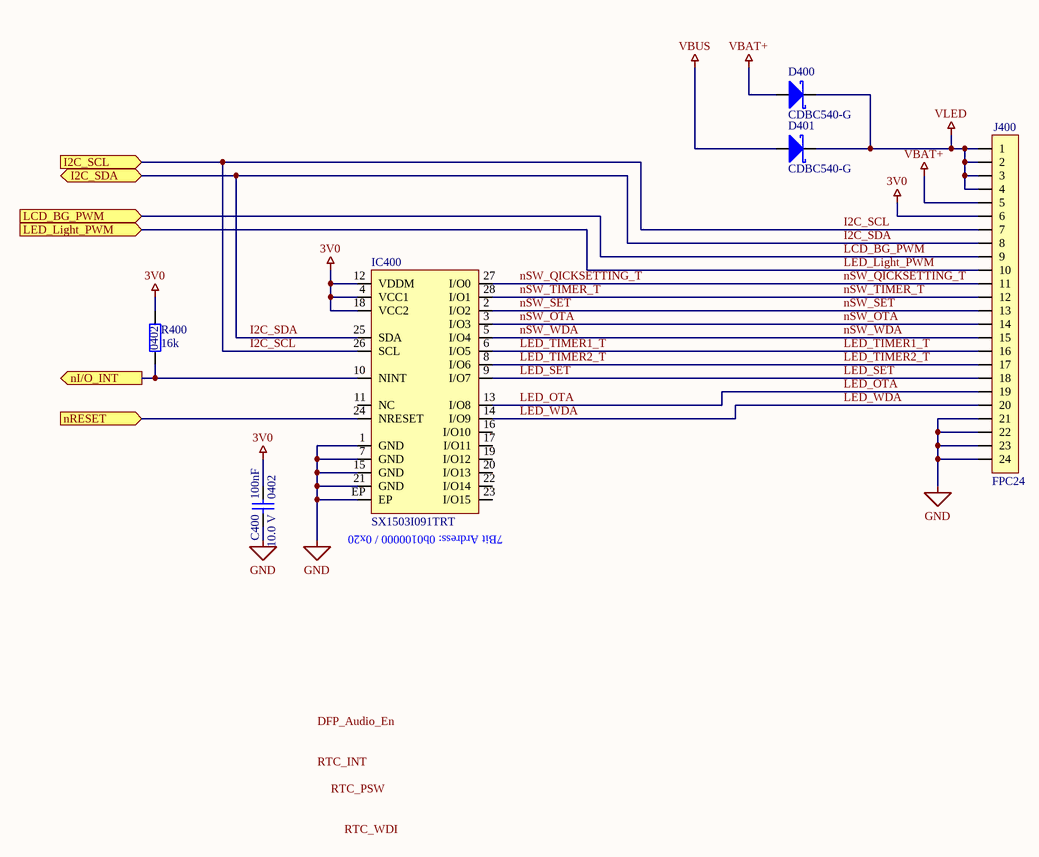
[diagram p4: Sheet4_LCD_Interface.SchDoc]

### Parts
C400  Capacitance: 100nF  Footprint: 0402  Voltage: 10.0 V  [C_0402]  (hidden comment: C 100nF 0402 10V)
D400  Manufacturer Part Number: CDBC540-G  [DO-214AB]  (hidden comment: D SCH 40V 5A)
D401  Manufacturer Part Number: CDBC540-G  [DO-214AB]  (hidden comment: D SCH 40V 5A)
IC400  SX1503I091TRT  [UFQFN-28-EP]
J400  FPC24  [J_FPC_522712479]
R400  Resistance: 16k  Footprint: 0402  [R_0402]  (hidden comment: R 16k 0402)

### Ports
I2C_SCL (in), I2C_SDA (bidir), LCD_BG_PWM (in), LED_Light_PWM (in), nI/O_INT (out), nRESET (in)

### Nets
3V0: C400.2 IC400.4(VCC1) IC400.12(VDDM) IC400.18(VCC2) J400.6 R400.2
GND: C400.1 IC400.1(GND) IC400.7(GND) IC400.15(GND) IC400.21(GND) IC400.EP J400.21 J400.22 J400.23 J400.24
VBAT+: D400.2(A) J400.5
VBUS: D401.2(A)
VLED: D400.1(K) D401.1(K) J400.1 J400.2 J400.3 J400.4
I2C_SCL: IC400.26(SCL) J400.7 ; port I2C_SCL
I2C_SDA: IC400.25(SDA) J400.8 ; port I2C_SDA
LCD_BG_PWM: J400.9 ; port LCD_BG_PWM
LED_Light_PWM: J400.10 ; port LED_Light_PWM
LED_OTA: IC400.13(I/O8) J400.19
LED_SET: IC400.9(I/O7) J400.18
LED_TIMER1_T: IC400.6(I/O5) J400.16
LED_TIMER2_T: IC400.8(I/O6) J400.17
LED_WDA: IC400.14(I/O9) J400.20
nI/O_INT: IC400.10(NINT) R400.1 ; port nI/O_INT
nSW_OTA: IC400.3(I/O3) J400.14
nSW_QICKSETTING_T: IC400.27(I/O0) J400.11
nSW_SET: IC400.2(I/O2) J400.13
nSW_TIMER_T: IC400.28(I/O1) J400.12
nSW_WDA: IC400.5(I/O4) J400.15
NetIC400_24: IC400.24(NRESET) ; port nRESET

Not connected (* = marked no-connect by the designer): IC400 11(NC) 16(I/O10) 17(I/O11) 19(I/O12) 20(I/O13) 22(I/O14) 23(I/O15)

### Notes on the sheet
- (near IC400) 7Bit Ardress: 0b0100000 / 0x20
- Labels drawn without touching a wire or pin: DFP_Audio_En, RTC_INT, RTC_PSW, RTC_WDI
- Title
- Size:
- Date:
- A4
- Number:
- Time:
- Revision:
- Sheet
- of
- File:

### Library data of the parts
C400 = CAP_100nF_10V_0402: as C204 on sheet Sheet2_Power_Supply; Supplier 1: Digi-Key; Supplier Part Number 1: 1276-1443-1-ND
D400 D401 = D_SCH_40V_5A: DIODE SCHOTTKY 40V 5A DO214AB; Manufacturer: Comchip Technology; Type: Diode; Supplier 1: Digi-Key; Supplier Part Number 1: 641-1126-1-ND
IC400 = IC_16ch_Port_Extender_2: IC GPIO EXPANDER I2C 16CH 28-QFN; Manufacturer: Semtech Corporation; Manufacturer Part Number: SX1503I091TRT; Type: IC, Driver; Supplier 1: Digi-Key; Supplier Part Number 1: SX1503I091CT-ND
J400 = J_FPC24_DS: as J500 on sheet Sheet5_LCD; Type: Connector; Supplier 1: LCSC; Supplier Part Number 1: C293627; Pins: 24
R400 = R_16k_0402: as R201 on sheet Sheet2_Power_Supply; Type: Resistor; Supplier 1: Digi-Key; Supplier Part Number 1: RMCF0402FT16K0CT-ND

## Nets that join several sheets
3V0: Sheet2_Power_Supply (7 pins), Sheet3_MCU (15 pins), Sheet4_LCD_Interface (6 pins)
GND: Sheet2_Power_Supply (29 pins), Sheet3_MCU (20 pins), Sheet4_LCD_Interface (10 pins)
VBAT+: Sheet2_Power_Supply (10 pins), Sheet3_MCU (IC300.7 P300.2 R311.2), Sheet4_LCD_Interface (D400.2 J400.5)
VBUS: Sheet2_Power_Supply (7 pins), Sheet4_LCD_Interface (D401.2)
VLED: Sheet2_Power_Supply (D201.A D202.A J201.2), Sheet4_LCD_Interface (6 pins)
I2C_SCL: Sheet3_MCU (IC300.4 IC301.6 IC302.16 R314.1), Sheet4_LCD_Interface (IC400.26 J400.7)
I2C_SDA: Sheet3_MCU (IC300.5 IC301.5 IC302.17 R313.1), Sheet4_LCD_Interface (IC400.25 J400.8)
LCD_BG_PWM: Sheet3_MCU (IC302.13), Sheet4_LCD_Interface (J400.9)
LED_Light_PWM: Sheet3_MCU (IC302.14), Sheet4_LCD_Interface (J400.10)
nI/O_INT: Sheet3_MCU (IC302.1), Sheet4_LCD_Interface (IC400.10 R400.1)

## Assembly variants
AlarmClock_JLC: not fitted R400